# EAGLE schematic Orbiter_V3_2 (EAGLE 8.7.1)

## Sheet 1 of 2: LED and Driver
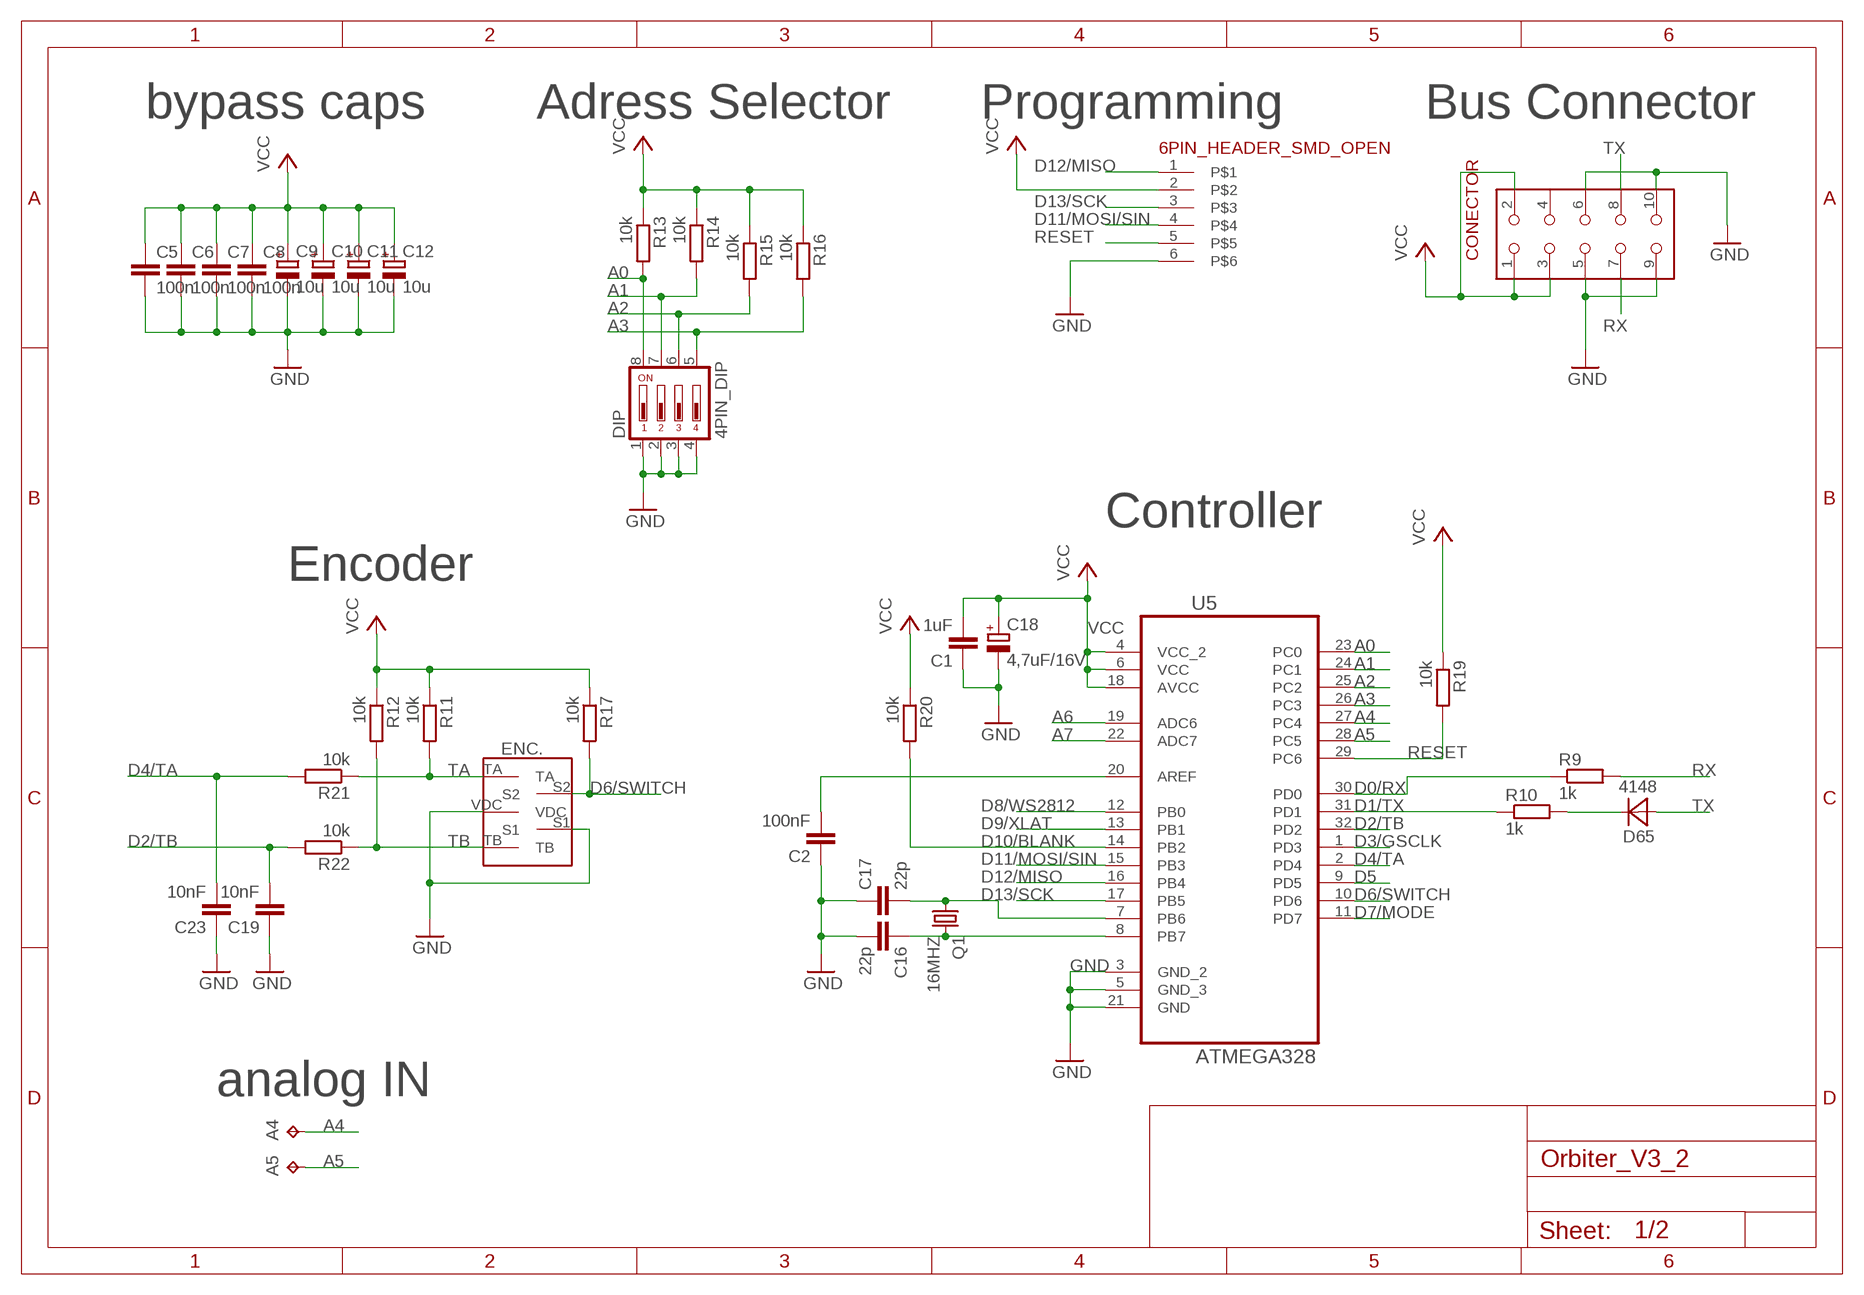
[diagram p0: schematic, sheet 1]

### Parts
A4  TPSMD  [TP]
A5  TPSMD  [TP]
C1  1uF  CAPACITOR"  [C0603]
C2  100nF  CAPACITOR"  [C0603]
C5  100n  CAPACITOR"  [C0603]
C6  100n  CAPACITOR"  [C0603]
C7  100n  CAPACITOR"  [C0603]
C8  100n  CAPACITOR"  [C0603]
C9  10u  SMD_ELCTROLYTIC  [153CLV-0605]
C10  10u  SMD_ELCTROLYTIC  [153CLV-0605]
C11  10u  SMD_ELCTROLYTIC  [153CLV-0605]
C12  10u  SMD_ELCTROLYTIC  [153CLV-0605]
C16  22p  CAPACITOR"  [C0603]
C17  22p  CAPACITOR"  [C0603]
C18  4,7uF/16V  SMD_ELCTROLYTIC  [153CLV-0605]
C19  10nF  CAPACITOR"  [C0603]
C23  10nF  CAPACITOR"  [C0603]
CONECTOR  10PIN_HEADER_SMD  [87832-10]
D65  4148  [SOD323-R]
DIP  4PIN_DIP  [CTS-219-04]
ENC.  BOURNS_ENCODER  [BOURNS_ENCODER_SMD]
PROG.  6PIN_HEADER_SMD_OPEN  [6PIN_HEADER_SMD_OPEN]
Q1  16MHZ  CRYSTAL_SM49  [SM49]
R9  1k  RESISTOR"  [R0805]
R10  1k  RESISTOR"  [R0805]
R11  10k  RESISTOR"  [R0805]
R12  10k  RESISTOR"  [R0805]
R13  10k  RESISTOR"  [R0805]
R14  10k  RESISTOR"  [R0805]
R15  10k  RESISTOR"  [R0805]
R16  10k  RESISTOR"  [R0805]
R17  10k  RESISTOR"  [R0805]
R19  10k  RESISTOR"  [R0805]
R20  10k  RESISTOR"  [R0805]
R21  10k  RESISTOR"  [R0805]
R22  10k  RESISTOR"  [R0805]
U5  ATMEGA328  ATMEGA328P-AU  [QFP80P900X900X120-32N]

### Nets
A0: DIP.8 R13.2 U5.23(PC0)
A1: DIP.7 R14.2 U5.24(PC1)
A2: DIP.6 R15.2 U5.25(PC2)
A3: DIP.5 R16.2 U5.26(PC3)
A4: A4.P$1(TP) U5.27(PC4)
A5: A5.P$1(TP) U5.28(PC5)
A6: U5.19(ADC6)
A7: U5.22(ADC7)
D0/RX: R9.1 U5.30(PD0)
D1/TX: R10.1 U5.31(PD1)
D2/TB: C19.2 R22.2 U5.32(PD2)
D3/GSCLK: U5.1(PD3) ; also sheet 2
D4/TA: C23.2 R21.2 U5.2(PD4)
D5: U5.9(PD5)
D6/SWITCH: ENC..S2 R17.2 U5.10(PD6)
D7/MODE: U5.11(PD7) ; also sheet 2
D8/WS2812: U5.12(PB0)
D9/XLAT: U5.13(PB1) ; also sheet 2
D10/BLANK: R20.2 U5.14(PB2) ; also sheet 2
D11/MOSI/SIN: PROG..4 U5.15(PB3) ; also sheet 2
D12/MISO: PROG..1 U5.16(PB4)
D13/SCK: PROG..3 U5.17(PB5) ; also sheet 2
GND: C1.1 C2.1 C5.2 C6.2 C7.2 C8.2 C9.- C10.- C11.- C12.- C16.2 C17.1 C18.- C19.1 C23.1 CONECTOR.5 CONECTOR.6 CONECTOR.9 CONECTOR.10 DIP.1 DIP.2 DIP.3 DIP.4 ENC..S1 ENC..VDC PROG..6 U5.3(GND_2) U5.5(GND_3) U5.21(GND) ; also sheet 2
N$77: D65.C R10.2
N$81: C17.2 Q1.1 U5.7(PB6)
N$82: C16.1 Q1.2 U5.8(PB7)
N$90: C2.2 U5.20(AREF)
RESET: PROG..5 R19.2 U5.29(PC6)
RX: CONECTOR.7 R9.2
TA: ENC..TA R11.2 R21.1
TB: ENC..TB R12.2 R22.1
TX: CONECTOR.8 D65.A
VCC: C1.2 C5.1 C6.1 C7.1 C8.1 C9.+ C10.+ C11.+ C12.+ C18.+ CONECTOR.1 CONECTOR.2 CONECTOR.3 PROG..2 R11.1 R12.1 R13.1 R14.1 R15.1 R16.1 R17.1 R19.1 R20.1 U5.4(VCC_2) U5.6(VCC) U5.18(AVCC) ; also sheet 2
Unconnected: CONECTOR.4

### Notes on the sheet
- bypass caps | Adress Selector | Programming | Bus Connector
- Controller
- Encoder
- analog IN

## Sheet 2 of 2: LED DRIVER
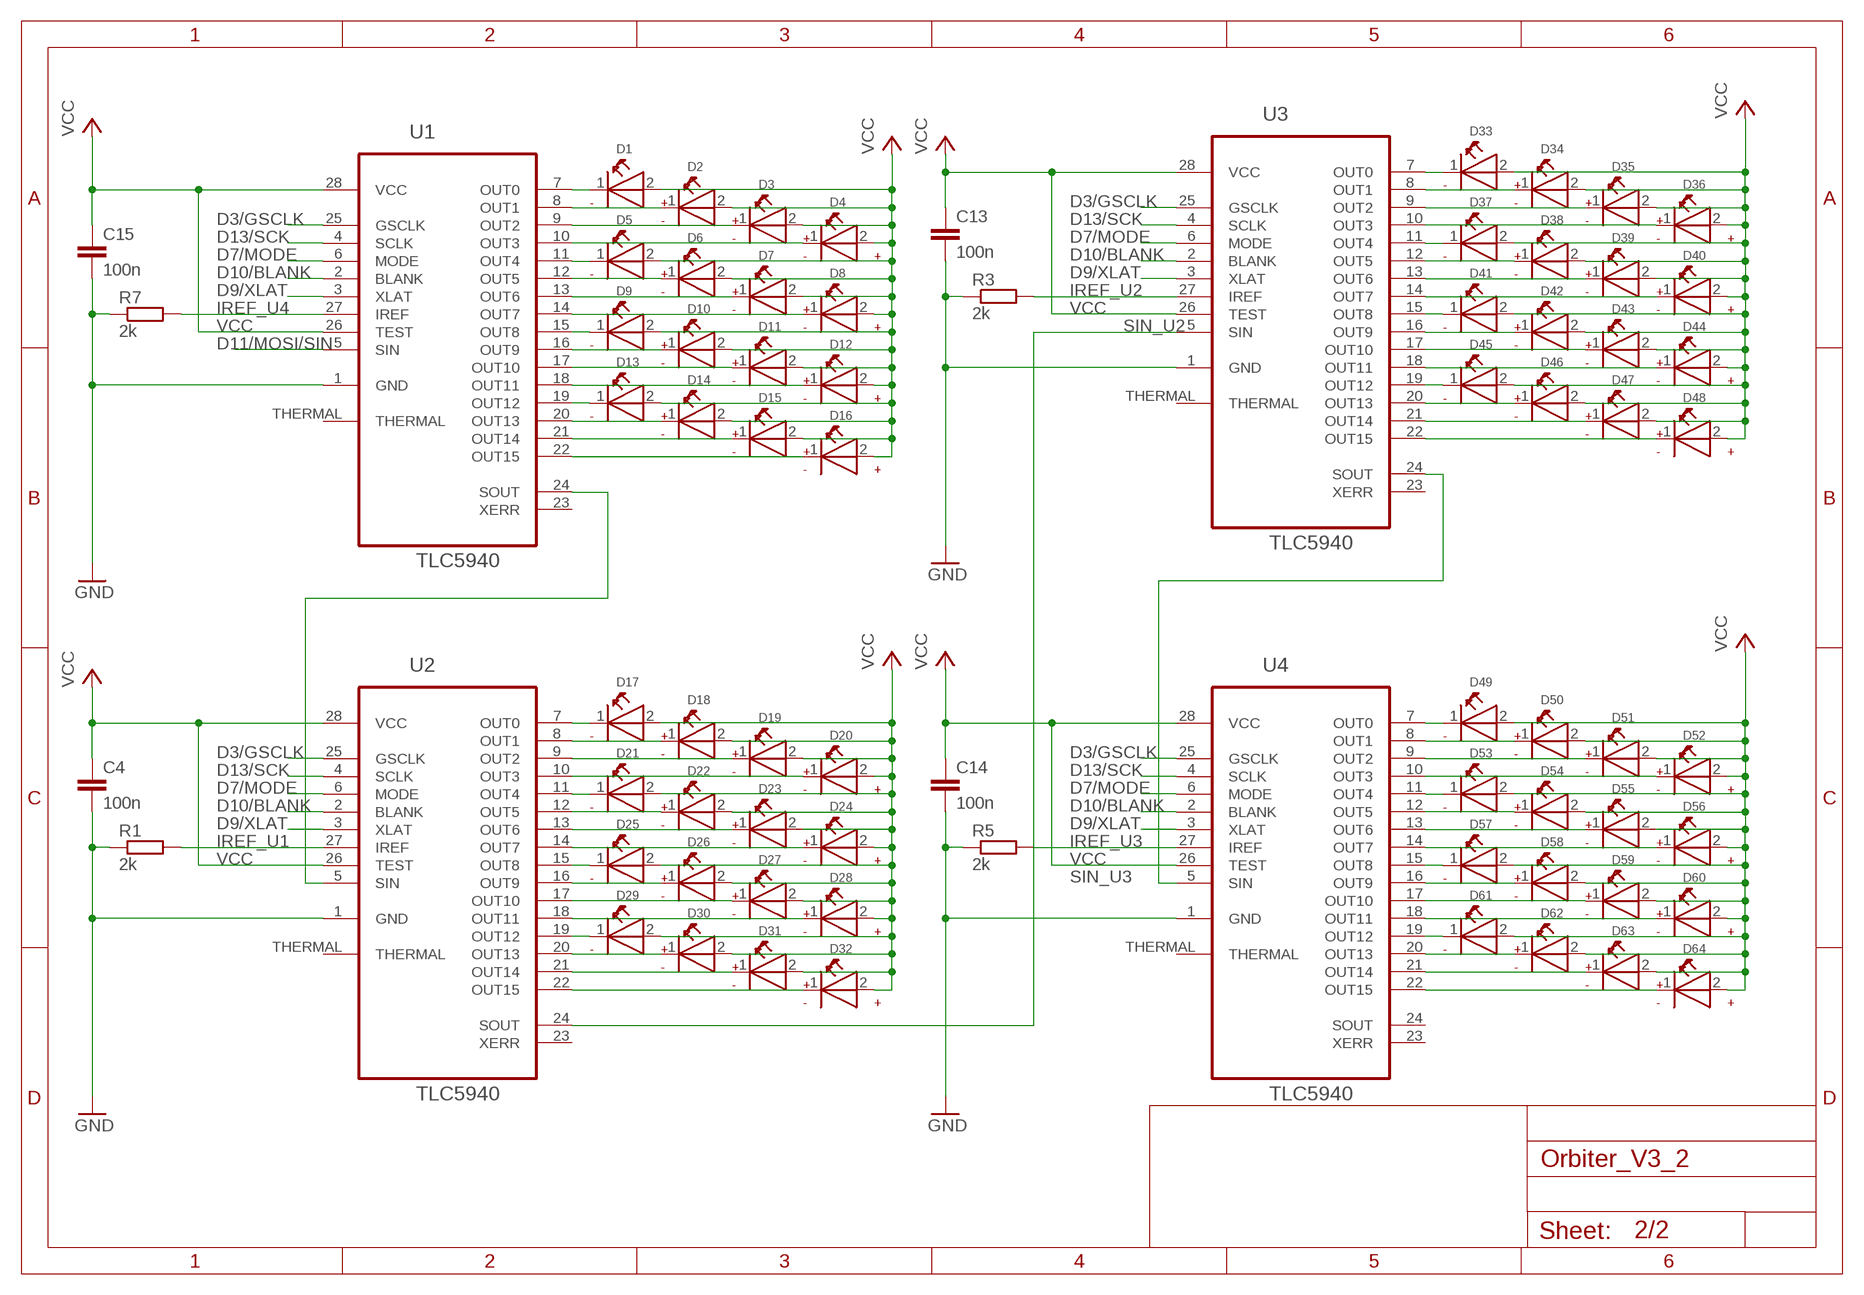
[diagram p1: schematic, sheet 2]

### Parts
C4  100n  CAPACITOR"  [C0603]
C13  100n  CAPACITOR"  [C0603]
C14  100n  CAPACITOR"  [C0603]
C15  100n  CAPACITOR"  [C0603]
D1  SMD_LED_0603  [WL-SMCW_0603]
D2  SMD_LED_0603  [WL-SMCW_0603]
D3  SMD_LED_0603  [WL-SMCW_0603]
D4  SMD_LED_0603  [WL-SMCW_0603]
D5  SMD_LED_0603  [WL-SMCW_0603]
D6  SMD_LED_0603  [WL-SMCW_0603]
D7  SMD_LED_0603  [WL-SMCW_0603]
D8  SMD_LED_0603  [WL-SMCW_0603]
D9  SMD_LED_0603  [WL-SMCW_0603]
D10  SMD_LED_0603  [WL-SMCW_0603]
D11  SMD_LED_0603  [WL-SMCW_0603]
D12  SMD_LED_0603  [WL-SMCW_0603]
D13  SMD_LED_0603  [WL-SMCW_0603]
D14  SMD_LED_0603  [WL-SMCW_0603]
D15  SMD_LED_0603  [WL-SMCW_0603]
D16  SMD_LED_0603  [WL-SMCW_0603]
D17  SMD_LED_0603  [WL-SMCW_0603]
D18  SMD_LED_0603  [WL-SMCW_0603]
D19  SMD_LED_0603  [WL-SMCW_0603]
D20  SMD_LED_0603  [WL-SMCW_0603]
D21  SMD_LED_0603  [WL-SMCW_0603]
D22  SMD_LED_0603  [WL-SMCW_0603]
D23  SMD_LED_0603  [WL-SMCW_0603]
D24  SMD_LED_0603  [WL-SMCW_0603]
D25  SMD_LED_0603  [WL-SMCW_0603]
D26  SMD_LED_0603  [WL-SMCW_0603]
D27  SMD_LED_0603  [WL-SMCW_0603]
D28  SMD_LED_0603  [WL-SMCW_0603]
D29  SMD_LED_0603  [WL-SMCW_0603]
D30  SMD_LED_0603  [WL-SMCW_0603]
D31  SMD_LED_0603  [WL-SMCW_0603]
D32  SMD_LED_0603  [WL-SMCW_0603]
D33  SMD_LED_0603  [WL-SMCW_0603]
D34  SMD_LED_0603  [WL-SMCW_0603]
D35  SMD_LED_0603  [WL-SMCW_0603]
D36  SMD_LED_0603  [WL-SMCW_0603]
D37  SMD_LED_0603  [WL-SMCW_0603]
D38  SMD_LED_0603  [WL-SMCW_0603]
D39  SMD_LED_0603  [WL-SMCW_0603]
D40  SMD_LED_0603  [WL-SMCW_0603]
D41  SMD_LED_0603  [WL-SMCW_0603]
D42  SMD_LED_0603  [WL-SMCW_0603]
D43  SMD_LED_0603  [WL-SMCW_0603]
D44  SMD_LED_0603  [WL-SMCW_0603]
D45  SMD_LED_0603  [WL-SMCW_0603]
D46  SMD_LED_0603  [WL-SMCW_0603]
D47  SMD_LED_0603  [WL-SMCW_0603]
D48  SMD_LED_0603  [WL-SMCW_0603]
D49  SMD_LED_0603  [WL-SMCW_0603]
D50  SMD_LED_0603  [WL-SMCW_0603]
D51  SMD_LED_0603  [WL-SMCW_0603]
D52  SMD_LED_0603  [WL-SMCW_0603]
D53  SMD_LED_0603  [WL-SMCW_0603]
D54  SMD_LED_0603  [WL-SMCW_0603]
D55  SMD_LED_0603  [WL-SMCW_0603]
D56  SMD_LED_0603  [WL-SMCW_0603]
D57  SMD_LED_0603  [WL-SMCW_0603]
D58  SMD_LED_0603  [WL-SMCW_0603]
D59  SMD_LED_0603  [WL-SMCW_0603]
D60  SMD_LED_0603  [WL-SMCW_0603]
D61  SMD_LED_0603  [WL-SMCW_0603]
D62  SMD_LED_0603  [WL-SMCW_0603]
D63  SMD_LED_0603  [WL-SMCW_0603]
D64  SMD_LED_0603  [WL-SMCW_0603]
R1  2k  RESISTOR"  [R0805]
R3  2k  RESISTOR"  [R0805]
R5  2k  RESISTOR"  [R0805]
R7  2k  RESISTOR"  [R0805]
U1  TLC5940  TLC59401PWP  [SOP65P640X120-29N]
U2  TLC5940  TLC59401PWP  [SOP65P640X120-29N]
U3  TLC5940  TLC59401PWP  [SOP65P640X120-29N]
U4  TLC5940  TLC59401PWP  [SOP65P640X120-29N]

### Nets
D3/GSCLK: U1.25(GSCLK) U2.25(GSCLK) U3.25(GSCLK) U4.25(GSCLK) ; also sheet 1
D7/MODE: U1.6(MODE) U2.6(MODE) U3.6(MODE) U4.6(MODE) ; also sheet 1
D9/XLAT: U1.3(XLAT) U2.3(XLAT) U3.3(XLAT) U4.3(XLAT) ; also sheet 1
D10/BLANK: U1.2(BLANK) U2.2(BLANK) U3.2(BLANK) U4.2(BLANK) ; also sheet 1
D11/MOSI/SIN: U1.5(SIN) ; also sheet 1
D13/SCK: U1.4(SCLK) U2.4(SCLK) U3.4(SCLK) U4.4(SCLK) ; also sheet 1
GND: C4.2 C13.2 C14.2 C15.2 R1.1 R3.1 R5.1 R7.1 U1.1(GND) U2.1(GND) U3.1(GND) U4.1(GND) ; also sheet 1
IREF_U1: R1.2 U2.27(IREF)
IREF_U2: R3.2 U3.27(IREF)
IREF_U3: R5.2 U4.27(IREF)
IREF_U4: R7.2 U1.27(IREF)
N$1: D17.1(-) U2.7(OUT0)
N$2: U1.24(SOUT) U2.5(SIN)
N$3: D18.1(-) U2.8(OUT1)
N$4: D24.1(-) U2.14(OUT7)
N$5: D19.1(-) U2.9(OUT2)
N$6: D25.1(-) U2.15(OUT8)
N$7: D20.1(-) U2.10(OUT3)
N$8: D26.1(-) U2.16(OUT9)
N$9: D21.1(-) U2.11(OUT4)
N$10: D22.1(-) U2.12(OUT5)
N$11: D23.1(-) U2.13(OUT6)
N$12: D27.1(-) U2.17(OUT10)
N$13: D28.1(-) U2.18(OUT11)
N$14: D29.1(-) U2.19(OUT12)
N$15: D30.1(-) U2.20(OUT13)
N$16: D31.1(-) U2.21(OUT14)
N$17: D32.1(-) U2.22(OUT15)
N$19: D33.1(-) U3.7(OUT0)
N$20: D34.1(-) U3.8(OUT1)
N$21: D35.1(-) U3.9(OUT2)
N$22: D36.1(-) U3.10(OUT3)
N$23: D37.1(-) U3.11(OUT4)
N$24: D38.1(-) U3.12(OUT5)
N$25: D39.1(-) U3.13(OUT6)
N$26: D40.1(-) U3.14(OUT7)
N$27: D41.1(-) U3.15(OUT8)
N$28: D42.1(-) U3.16(OUT9)
N$29: D43.1(-) U3.17(OUT10)
N$31: D44.1(-) U3.18(OUT11)
N$32: D45.1(-) U3.19(OUT12)
N$33: D46.1(-) U3.20(OUT13)
N$34: D47.1(-) U3.21(OUT14)
N$35: D48.1(-) U3.22(OUT15)
N$39: D49.1(-) U4.7(OUT0)
N$40: D50.1(-) U4.8(OUT1)
N$41: D51.1(-) U4.9(OUT2)
N$42: D52.1(-) U4.10(OUT3)
N$43: D53.1(-) U4.11(OUT4)
N$44: D54.1(-) U4.12(OUT5)
N$45: D55.1(-) U4.13(OUT6)
N$46: D56.1(-) U4.14(OUT7)
N$47: D57.1(-) U4.15(OUT8)
N$48: D58.1(-) U4.16(OUT9)
N$49: D59.1(-) U4.17(OUT10)
N$50: D60.1(-) U4.18(OUT11)
N$51: D61.1(-) U4.19(OUT12)
N$52: D62.1(-) U4.20(OUT13)
N$53: D63.1(-) U4.21(OUT14)
N$54: D64.1(-) U4.22(OUT15)
N$58: D1.1(-) U1.7(OUT0)
N$59: D2.1(-) U1.8(OUT1)
N$60: D3.1(-) U1.9(OUT2)
N$61: D4.1(-) U1.10(OUT3)
N$62: D5.1(-) U1.11(OUT4)
N$63: D6.1(-) U1.12(OUT5)
N$64: D7.1(-) U1.13(OUT6)
N$65: D8.1(-) U1.14(OUT7)
N$66: D9.1(-) U1.15(OUT8)
N$67: D10.1(-) U1.16(OUT9)
N$68: D11.1(-) U1.17(OUT10)
N$69: D12.1(-) U1.18(OUT11)
N$70: D13.1(-) U1.19(OUT12)
N$71: D14.1(-) U1.20(OUT13)
N$72: D15.1(-) U1.21(OUT14)
N$73: D16.1(-) U1.22(OUT15)
SIN_U2: U2.24(SOUT) U3.5(SIN)
SIN_U3: U3.24(SOUT) U4.5(SIN)
VCC: C4.1 C13.1 C14.1 C15.1 D1.2(+) D2.2(+) D3.2(+) D4.2(+) D5.2(+) D6.2(+) D7.2(+) D8.2(+) D9.2(+) D10.2(+) D11.2(+) D12.2(+) D13.2(+) D14.2(+) D15.2(+) D16.2(+) D17.2(+) D18.2(+) D19.2(+) D20.2(+) D21.2(+) D22.2(+) D23.2(+) D24.2(+) D25.2(+) D26.2(+) D27.2(+) D28.2(+) D29.2(+) D30.2(+) D31.2(+) D32.2(+) D33.2(+) D34.2(+) D35.2(+) D36.2(+) D37.2(+) D38.2(+) D39.2(+) D40.2(+) D41.2(+) D42.2(+) D43.2(+) D44.2(+) D45.2(+) D46.2(+) D47.2(+) D48.2(+) D49.2(+) D50.2(+) D51.2(+) D52.2(+) D53.2(+) D54.2(+) D55.2(+) D56.2(+) D57.2(+) D58.2(+) D59.2(+) D60.2(+) D61.2(+) D62.2(+) D63.2(+) D64.2(+) U1.26(TEST) U1.28(VCC) U2.26(TEST) U2.28(VCC) U3.26(TEST) U3.28(VCC) U4.26(TEST) U4.28(VCC) ; also sheet 1
Unconnected: U1.23(XERR) U1.THERMAL U2.23(XERR) U2.THERMAL U3.23(XERR) U3.THERMAL U4.23(XERR) U4.24(SOUT) U4.THERMAL

## Library data of the parts
A4 A5 = C_Sager_Bibliothek:TP
C1 C2 C4-C8 C13-C17 C19 C23 = C_Sager_Bibliothek:CAPACITOR: capacitor
C9-C12 C18 = C_Sager_Bibliothek:SMD_ELCTROLYTIC: SMD Elektrolyt Kondensator 153CLV-0605
CONECTOR = C_Sager_Bibliothek:10PIN_HEADER_SMD: 10 Pin Header (Flachbandkabel)
D1-D64 = C_Sager_Bibliothek:SMD_LED_0603: SMD LED 0603
D65 = C_Sager_Bibliothek:4148: Standard 4148 Diode SOD323 Format
DIP = C_Sager_Bibliothek:4PIN_DIP: 4 Bit DipSwitch
ENC. = C_Sager_Bibliothek:BOURNS_ENCODER: Bourns Rotay Encoder (Rückseitig)
PROG. = C_Sager_Bibliothek:6PIN_HEADER_SMD_OPEN: 6 Pin Header SMD
Q1 = C_Sager_Bibliothek:CRYSTAL_SM49: Quarz in SM49
R1 R3 R5 R7 R9-R17 R19-R22 = C_Sager_Bibliothek:RESISTOR: +/- 5 % resistor
U1-U4 = C_Sager_Bibliothek:TLC59401PWP: 16-CHANNEL LED DRIVER; MPN: TLC59401PWP; OC_FARNELL: -; OC_NEWARK: 64R0661; PACKAGE: TSSOP-28; SUPPLIER: Texas Instruments
U5 = C_Sager_Bibliothek:ATMEGA328P-AU: 8-bit Microcontroller with In-System Programmable Flash; MPN: ATMEGA328P-AU; OC_FARNELL: 1715486; OC_NEWARK: 14R4631; PACKAGE: TQFP-32; SUPPLIER: Atmel